# EAGLE design ArduOSD (EAGLE 6.0)
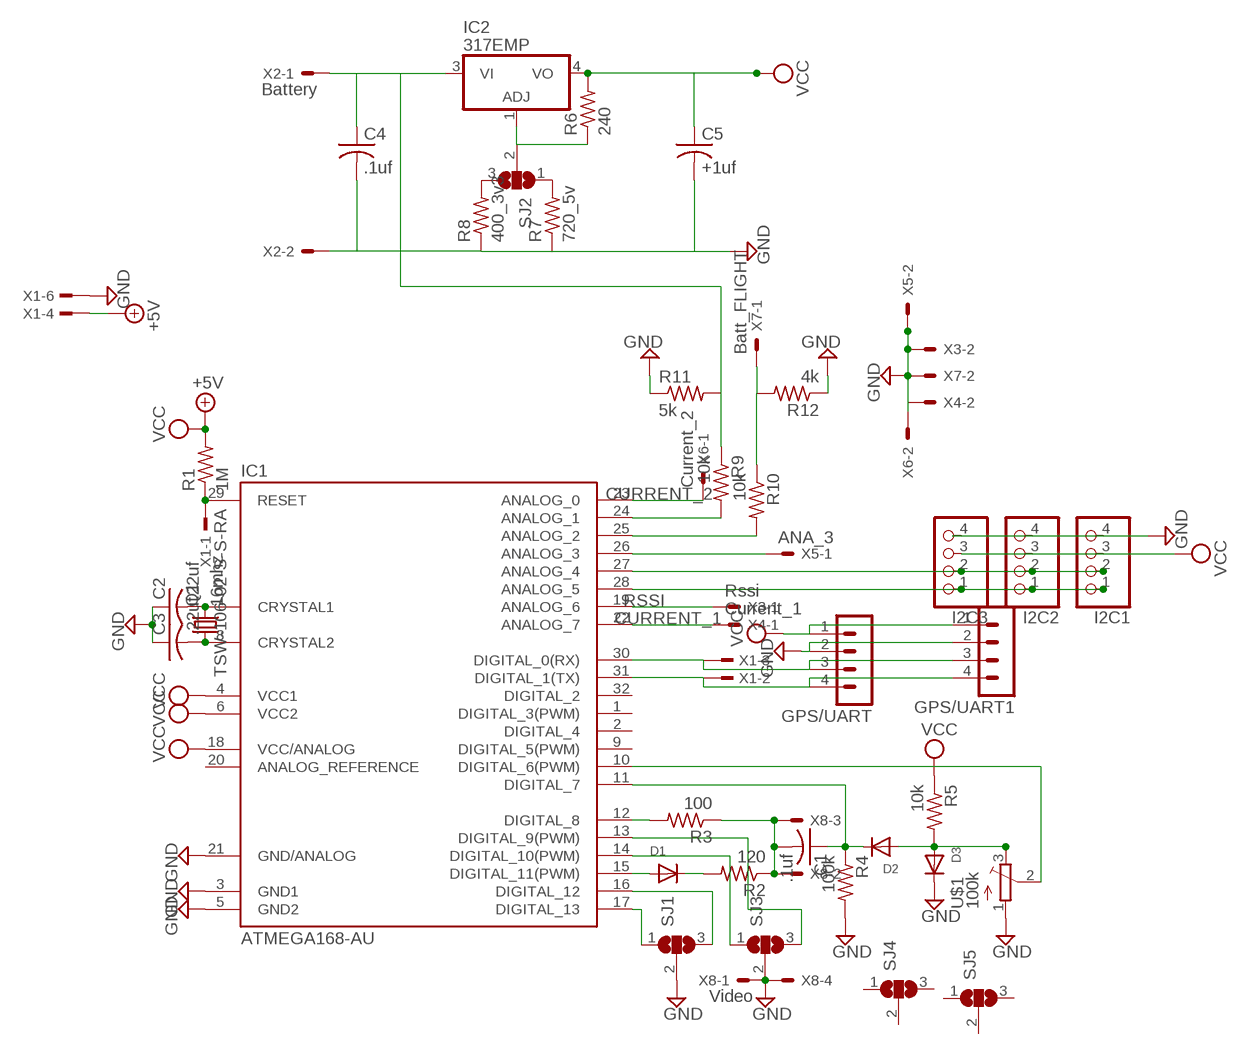
[diagram p0: schematic, sheet 1]

## Parts
C1  .1uf  C-USC0805K  [C0805K]
C2  .22uf  C-USC0805K  [C0805K]
C3  .22uf  C-USC0805K  [C0805K]
C4  .1uf  C-USC0805K  [C0805K]
C5  +1uf  C-US025-060X050  [C025-060X050]
D1  DIODESOT23_WAVE  [SOT23-W]
D2  DIODESOT23_WAVE  [SOT23-W]
D3  DIODESOT23_WAVE  [SOT23-W]
GPS/UART  MA04-1  [MA04-1]
GPS/UART1  MA04-1  [MA04-1]
I2C1  PINHD-1X4  [1X04]
I2C2  PINHD-1X4  [1X04]
I2C3  PINHD-1X4  [1X04]
IC1  ATMEGA168-AU  [TQFP32-08]
IC2  317EMP  [SOT223]
Q1  16mhz  CSM-7X-DU  [CSM-7X-DU]
R1  1M  R-US_M0805  [M0805]
R2  120  R-US_M0805  [M0805]
R3  100  R-US_M0805  [M0805]
R4  100k  R-US_M0805  [M0805]
R5  10k  R-US_M0805  [M0805]
R6  240  R-US_R0805  [R0805]
R7  720_5v  R-US_R0805  [R0805]
R8  400_3v3  R-US_R0805  [R0805]
R9  10k  R-US_M0805  [M0805]
R10  10k  R-US_M0805  [M0805]
R11  5k  R-US_M0805  [M0805]
R12  4k  R-US_M0805  [M0805]
SJ1  SJ2W  [SJ_2]
SJ2  SJ2W  [SJ_2]
SJ3  SJ2W  [SJ_2]
SJ4  SJ2W  [SJ_2]
SJ5  SJ2W  [SJ_2]
U$1  100k  TRIMPOTTC33X  [TC33X]
X1  TSW-106-02-S-S-RA  [TSW-106-02-S-S-RA]
X2  Battery  22-23-2021  [22-23-2021]
X3  Rssi  22-23-2021  [22-23-2021]
X4  Current_1  22-23-2021  [22-23-2021]
X5  ANA_3  22-23-2021  [22-23-2021]
X6  Current_2  22-23-2021  [22-23-2021]
X7  Batt_FLIGHT  22-23-2021  [22-23-2021]
X8  Video  22-23-2041  [22-23-2041]

## Nets
+5V: X1.4
ANA_3: IC1.26(ANALOG_3) X5.1
BATT_FPV: C4.1 IC2.3(VI) R9.1 R11.2 X2.1
CURRENT_1: IC1.22(ANALOG_7) X4.1
CURRENT_2: IC1.23(ANALOG_0) X6.1
GND: C2.1 C3.1 C4.2 C5.2 D3.3(C) GPS/UART1.2 GPS/UART.2 I2C1.4 I2C2.4 I2C3.4 IC1.3(GND1) IC1.5(GND2) IC1.21(GND/ANALOG) R4.2 R7.1 R8.1 R11.1 R12.1 SJ1.2 SJ3.2 U$1.1(A) X1.6 X2.2 X3.2 X4.2 X5.2 X6.2 X7.2 X8.1 X8.4
GPS_DAT: GPS/UART1.3 GPS/UART.3 IC1.30(DIGITAL_0(RX)) X1.3
N$1: IC1.29(RESET) R1.1 X1.1
N$2: D1.1(A) IC1.15(DIGITAL_11(PWM))
N$3: D1.3(C) R2.2
N$4: IC1.12(DIGITAL_8) R3.2
N$5: C1.2 R2.1 R3.1 X8.2 X8.3
N$6: C1.1 D2.3(C) IC1.11(DIGITAL_7) R4.1
N$7: D2.1(A) D3.1(A) R5.2 U$1.3(E)
N$8: IC1.10(DIGITAL_6(PWM)) U$1.2(S)
N$9: GPS/UART1.4 GPS/UART.4 IC1.31(DIGITAL_1(TX)) X1.2
N$11: C2.2 IC1.7(CRYSTAL1) Q1.2
N$12: C3.2 IC1.8(CRYSTAL2) Q1.1
N$13: IC1.25(ANALOG_2) R10.2
N$14: IC1.24(ANALOG_1) R9.2
N$15: IC1.16(DIGITAL_12) SJ1.3
N$16: IC1.17(DIGITAL_13) SJ1.1
N$17: IC2.1(ADJ) R6.1 SJ2.2
N$18: R7.2 SJ2.1
N$19: R10.1 R12.2 X7.1
N$20: R8.2 SJ2.3
N$21: IC1.14(DIGITAL_10(PWM)) SJ3.1
N$22: IC1.13(DIGITAL_9(PWM)) SJ3.3
RSSI: IC1.19(ANALOG_6) X3.1
SCL: I2C1.1 I2C2.1 I2C3.1 IC1.28(ANALOG_5)
SDA: I2C1.2 I2C2.2 I2C3.2 IC1.27(ANALOG_4)
VCC: C5.1 GPS/UART1.1 GPS/UART.1 I2C1.3 I2C2.3 I2C3.3 IC1.4(VCC1) IC1.6(VCC2) IC1.18(VCC/ANALOG) IC2.4(VO) R1.2 R5.1 R6.2 ; supply symbol labelled +5V
Unconnected: IC1.1(DIGITAL_3(PWM)) IC1.2(DIGITAL_4) IC1.9(DIGITAL_5(PWM)) IC1.20(ANALOG_REFERENCE) IC1.32(DIGITAL_2) SJ4.1 SJ4.2 SJ4.3 SJ5.1 SJ5.2 SJ5.3 X1.5

## Library data of the parts
C1-C5 = adafruit:C-US: CAPACITOR, American symbol
D1-D3 = adafruit:DIODE: Diode SMADIODE - SMA Surface Mount Package 20V 1A Schottky Diode Digikey: 641-1014-6-ND DO-1N4148 - Through Hole Small Current Diode SOD-123 20V 1 A (.5mV Vf) Schottky Diode - Digikey: MBRX120TPMSCT-ND SOD-323 10V 570mA (.38mV Vf, 3ns) Schottky Diode - Digikey: ZLLS410CT-ND SOD-523 30V 30mA Schottky Diode (RB751S-40TE61) - Digikey: RB751S-40TE61CT-ND SOT23-R/W - SOT23 Package (R = Solder Paste/Reflow Ovens, W = Hand-Soldering) BAT54Film 40V 300mA - Digikey: 497-7162-1-ND
GPS/UART GPS/UART1 = con-lstb:MA04-1: PIN HEADER; OC_FARNELL: unknown; OC_NEWARK: unknown
I2C1-I2C3 = pinhead:PINHD-1X4: PIN HEADER
IC1 = Arduino-AVR:ATMEGA168
IC2 = linear:*317: Positive VOLTAGE REGULATOR
Q1 = crystal:CSM-7X-DU: SMD CRYSTAL Source: www.ecsxtal.com .. Crystal 3.6864MHz CSM_7X_DU.PDF; OC_FARNELL: unknown; OC_NEWARK: unknown
R1-R12 = adafruit:R-US_: RESISTOR, American symbol
SJ1-SJ5 = jumper:SJ2W: SMD solder JUMPER
U$1 = adafruit:TRIMPOT: SMT trimmer potentiometer part number TC33X http://www.ladyada.net/library/eagle
X1 = con-samtec:TSW-106-02-S-S: THROUGH-HOLE .025" SQ POST HEADER Source: Samtec TSW.pdf; OC_FARNELL: unknown; OC_NEWARK: unknown
X2-X7 = con-molex:22-23-2021: .100" (2.54mm) Center Header - 2 Pin; MF: MOLEX; MPN: 22-23-2021; OC_FARNELL: 1462926; OC_NEWARK: 25C3832
X8 = con-molex:22-23-2041: .100" (2.54mm) Center Header - 4 Pin; MF: MOLEX; MPN: 22-23-2041; OC_FARNELL: 1462920; OC_NEWARK: 38C0355

## Board
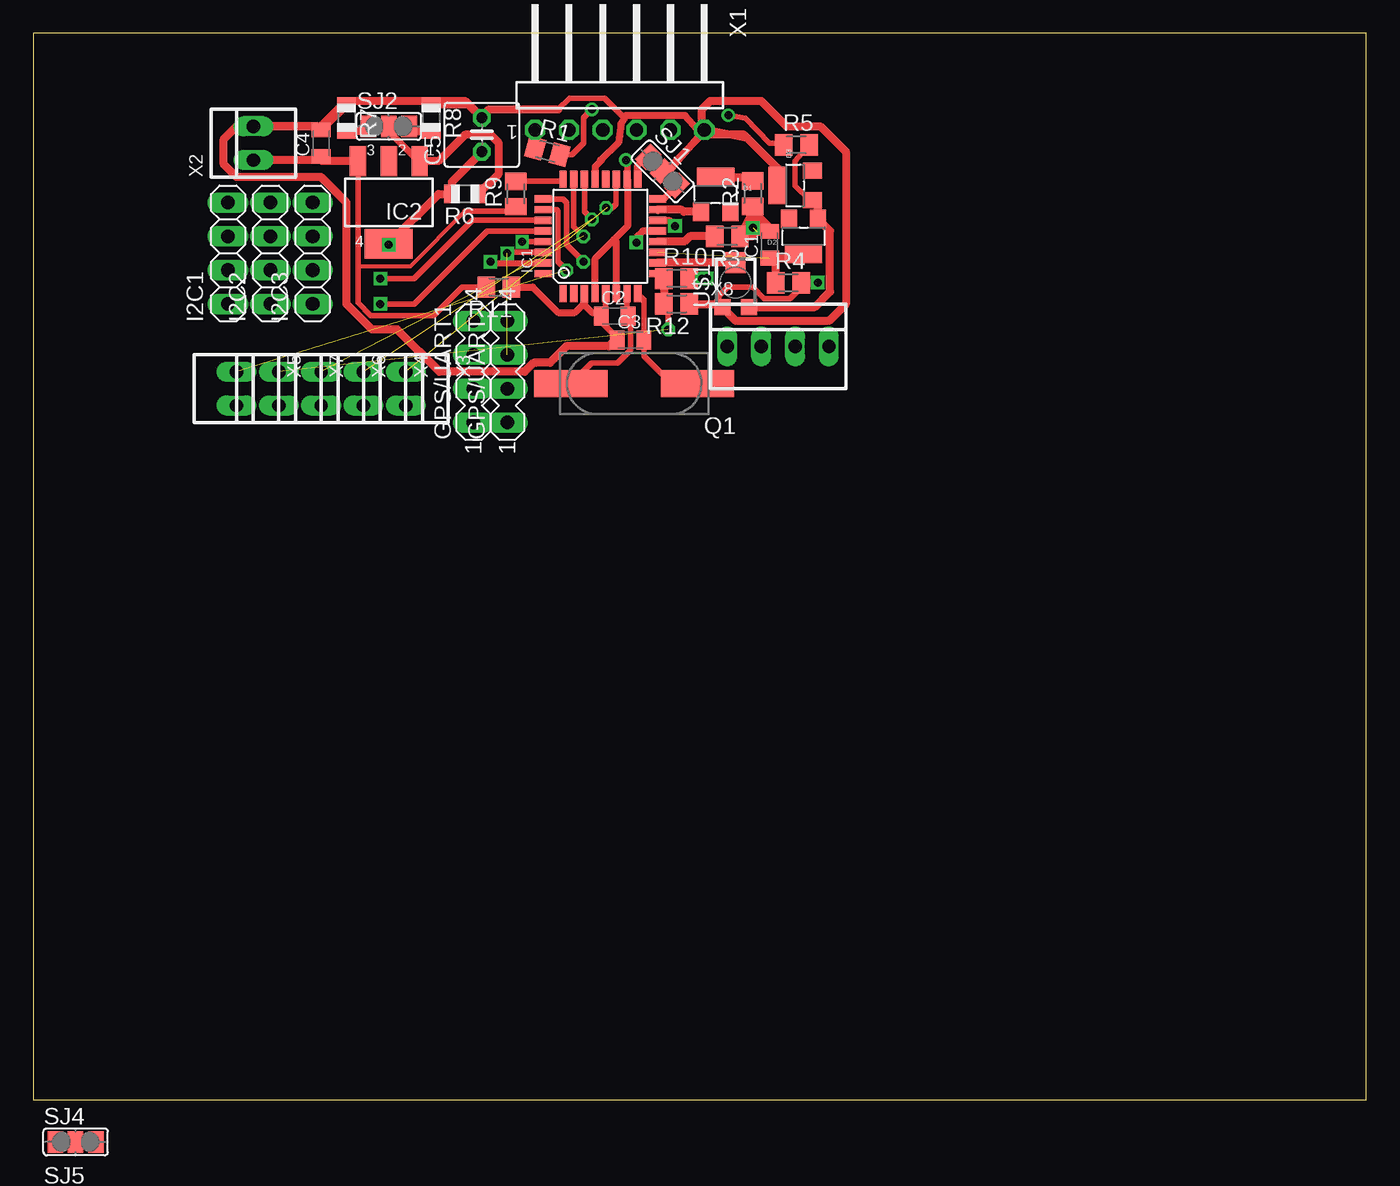
[diagram p1: board, top side]
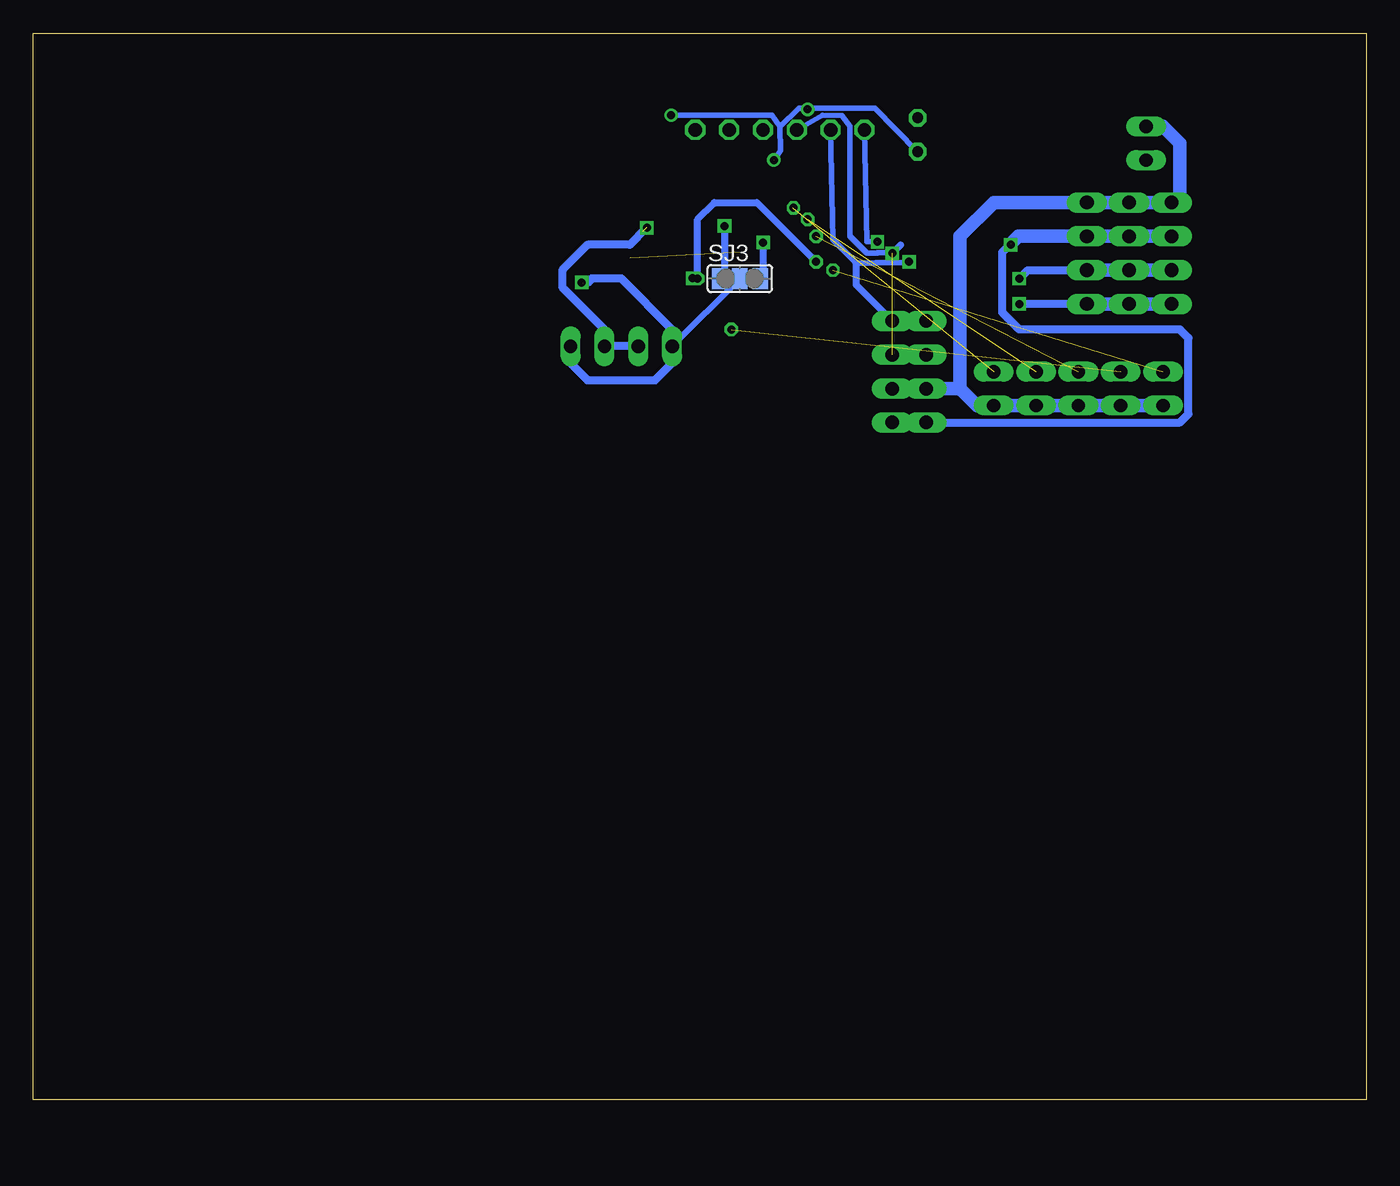
[diagram p2: board, bottom side, seen from below]

Size 100 x 80 mm. Coordinates in mm from the lower left corner, seen from the top.
Outline: 0,0 100,0 100,80 0,80 0,0
Copper layers (1*16): Top 0.035mm / dielectric 1.5mm / Bottom 0.035mm
Design rules: minimum track width 10mil, minimum drill 24mil, track to track 8mil, track to pad 8mil, pad to pad 8mil, via to via 8mil, smd to smd 8mil, copper to edge 40mil, drill to drill 8mil, minimum pad ring 10mil, minimum via ring 8mil, stop-mask expansion 4mil, vias tented up to drill 0mil, thermal gap 10mil

### Footprints (pad centres in the part's own frame; a part is rotated, then mirrored left to right if it is on the bottom)
C0805K = smd 1.1 x 1.4: 1 -1,0; 2 1,0
C025-060X050 = drill 0.813 octagon: 1 -1.27,0; 2 1.27,0
SOT23-W = smd 1.2 x 1.4: 1 -1.1,-1.3; 2 1.1,-1.3 | smd 2.8 x 1.4: 3 0,1.3
MA04-1 = drill 1.016 long: 1 -3.81,0; 2 -1.27,0; 3 1.27,0; 4 3.81,0
1X04 = drill 1.016 long: 1 -3.81,0; 2 -1.27,0; 3 1.27,0; 4 3.81,0
TQFP32-08 = smd 1.27 x 0.559: 1 -4.293,2.8; 2 -4.293,2; 3 -4.293,1.2; 4 -4.293,0.4; 5 -4.293,-0.4; 6 -4.293,-1.2; 7 -4.293,-2; 8 -4.293,-2.8; 17 4.293,-2.8; 18 4.293,-2; 19 4.293,-1.2; 20 4.293,-0.4; 21 4.293,0.4; 22 4.293,1.2; 23 4.293,2; 24 4.293,2.8 | smd 0.559 x 1.27: 9 -2.8,-4.293; 10 -2,-4.293; 11 -1.2,-4.293; 12 -0.4,-4.293; 13 0.4,-4.293; 14 1.2,-4.293; 15 2,-4.293; 16 2.8,-4.293; 25 2.8,4.293; 26 2,4.293; 27 1.2,4.293; 28 0.4,4.293; 29 -0.4,4.293; 30 -1.2,4.293; 31 -2,4.293; 32 -2.8,4.293
SOT223 = smd 1.219 x 2.235: 1 -2.311,-3.099; 2 0,-3.099; 3 2.311,-3.099 | smd 3.6 x 2.2: 4 0,3.099
CSM-7X-DU = smd 5.5 x 2: 1 -4.75,0; 2 4.75,0
M0805 = smd 1.3 x 1.6: 1 -0.95,0; 2 0.95,0
R0805 = smd 1.1 x 1.4: 1 -1,0; 2 1,0
SJ_2 = smd 1.168 x 1.6: 1 -1.524,0; 2 0,0; 3 1.524,0
TC33X = smd 1.2 x 1.2: 1 -1,-1.825; 3 1,-1.825 | smd 1.5 x 1.6: 2 0,1.5
TSW-106-02-S-S-RA = drill 1 pad 1.5 octagon: 1 6.35,1.524; 2 3.81,1.524; 3 1.27,1.524; 4 -1.27,1.524; 5 -3.81,1.524; 6 -6.35,1.524
22-23-2021 = drill 1 long: 1 -1.27,0; 2 1.27,0
22-23-2041 = drill 1 long: 1 -3.81,0; 2 -1.27,0; 3 1.27,0; 4 3.81,0

### Placement (x,y rotation side)
C1  55.24,64.14 90 top
C2  43.62,58.78 0 top
C3  44.81,56.98 0 top
C4  21.59,71.75 90 top
C5  33.66,72.39 90 top
D1  51.19,67.9 0 top
D2  57.78,64.77 180 top
D3  57.15,68.58 90 top
GPS/UART  35.56,54.61 90 top
GPS/UART1  33.02,54.61 90 top
I2C1  14.61,63.5 90 top
I2C2  17.78,63.5 90 top
I2C3  20.95,63.5 90 top
IC1  42.55,64.77 90 top
IC2  26.67,67.31 180 top
Q1  45.09,53.71 180 top
R1  38.57,71.14 345 top
R2  53.98,67.97 90 top
R3  52.07,64.77 180 top
R4  56.65,61.26 0 top
R5  57.25,71.62 0 top
R6  32.38,67.94 180 top
R7  23.5,73.66 270 top
R8  29.84,73.66 270 top
R9  36.2,67.94 90 top
R10  48.26,61.59 0 top
R11  34.92,60.96 180 top
R12  48.26,59.69 180 top
SJ1  47.22,69.64 315 top
SJ2  26.67,73.03 0 top
SJ3  46.99,61.59 0 bottom
SJ4  3.17,-3.17 0 top  (outside the outline)
SJ5  3.17,-7.62 0 top  (outside the outline)
U$1  52.69,61.29 0 top
X1  43.99,74.28 180 top
X2  16.51,71.75 90 top
X3  27.94,53.34 270 top
X4  24.77,53.34 270 top
X5  15.24,53.34 270 top
X6  21.59,53.34 270 top
X7  18.41,53.34 270 top
X8  55.88,56.52 0 top

### Tracks (layer width: path | path; a pad name or v marks a point on that pad's centre or on a via)
ANA_3  (via drill 0.6)  (1 unrouted)
  Top 0.406: IC1.26 39.27,66.77 39.37,66.67 39.37,62.87 v40.01,62.23
BATT_FPV
  Top 0.305: 32.38,66.67 28.27,62.5 24.37,62.5
  Top 0.406: IC2.3 24.36,70.34 24.37,62.5 24.37,60.11 24.37,60.21 24.37,59.79 25.32,58.83 30.05,58.83 32.16,60.96 R11.2 | R9.1 35.88,66.67 32.38,66.67
  Top 0.61: IC2.3 21.67,70.41 21.59,70.48 C4.1 21.32,70.48 X2.1
CURRENT_1  (via drill 0.6)  (1 unrouted)
  Top 0.406: IC1.22 41.34,66.61 v41.91,66.04
CURRENT_2  (via drill 0.6)  (1 unrouted)
  Top 0.406: IC1.23 40.55,65.5 v41.27,64.77
GND  (1 unrouted)
  Top 0: IC1.5 42.8,60.33 42.8,58.8 43.8,56.87 42.96,56.51 39.86,56.33 38.6,55.37 37.35,55.12 36.85,54.62 30.58,54.57 27.24,57.77 25.41,57.83 23.47,59.81 23.48,67.38 21.57,69.21 14.86,69.48 14.27,70.6 14.36,72.21 15.31,73.03 21.8,73 23.26,74.37 24.26,74.91 32.72,74.67 33.69,73.79
  Top 0.406: 42.95,58.02 42.62,58.35 C2.1 42.95,59.1 IC1.5 42.95,58.02 | C3.1 43.81,57.14 43.81,57.15 42.95,58.02 | R4.2 57.6,60.93 56.78,60.11 54.83,60.11 53.98,60.96 52.07,60.96 51.44,60.33 51.44,59.72 U$1.1 | 39.37,74.3 40.21,75.14 42.85,75.14 44.16,73.83 44.46,73.83
  Top 0.508: X1.6 47.67,69.64 SJ1.2 47.42,69.64 50.16,72.39 48.91,73.83 44.46,73.83 44.08,73.21 43.9,71.8 42.55,70.48 42.64,70.48 42.16,70.01 42.16,69.08 IC1.21 | R11.1 37.47,60.96 39.37,59.05 40.64,59.05 41.27,59.69 | 41.27,59.69 41.27,59.73 41.37,59.83 41.37,60.45 IC1.3 41.34,59.76 41.27,59.69 | 41.27,59.69 41.91,59.05 42.34,59.05 C2.1
  Top 0.61: 23.77,74.93 R7.1 C4.2 | 23.77,74.93 29.84,74.93 | 29.84,74.93 R8.1 32.66,74.66 C5.2 32.38,74.93 29.84,74.93 | C4.2 21.59,73.03 | R4.2 58.77,61.26 58.78,61.27 | R12.1 51.47,59.69 U$1.1 51.69,59.43 52.7,58.42 59.69,58.42 60.96,59.69 60.96,71.12 59.05,73.03 56.52,73.03 54.61,74.93 50.8,74.93 50.16,74.3 50.16,72.39 53.34,72.39 53.59,72.14 | 53.59,72.14 55.88,69.85 55.88,68.61 D3.3 | 53.59,72.14 X1.6 | 43.81,57.15 43.18,56.52 40.01,56.52 38.78,55.29 37.7,55.29 37.69,55.29 37.54,55.29 36.87,54.61 30.48,54.61 27.3,57.78 25.4,57.78 23.5,59.69 23.5,67.31 21.59,69.22 15.24,69.22 14.29,70.17 14.29,72.07 15.24,73.03 X2.2 | C4.2 21.32,73.03 X2.2 | X2.2 21.59,73.03 | 21.59,73.03 23.5,74.93 23.77,74.93 | 33.69,73.79 34.2,74.3 39.37,74.3
  Bottom 0.406: SJ3.2 X8.1
  Bottom 0.61: 58.77,61.26 58.42,61.26 58.09,61.59 55.88,61.59 52.07,57.78 X8.1 52.07,55.24 53.34,53.98 58.42,53.98 59.69,55.24 X8.4
  Bottom 1.016: I2C1.4 I2C2.4 I2C3.4 | X5.2 X7.2 X6.2 X4.2 X3.2 29.21,52.07 30.48,53.34 | I2C3.4 13.97,67.31 13.97,71.75 15.24,73.03 X2.2 | 30.48,53.34 30.48,64.77 27.94,67.31 I2C3.4 | GPS/UART.2 GPS/UART1.2 30.48,53.34
GPS_DAT  (via drill 0.6 pad 0.81)  (1 unrouted)
  Top 0.406: IC1.30 35.63,63.57 v35.56,63.5
  Bottom 0.406: X1.3 42.74,72.73 40.81,73.85 39.31,73.83 38.73,73.03 38.73,64.77 37.47,63.5 36.69,63.5 36.66,63.53 35.59,63.53 v35.56,63.5
  Bottom 0.508: v35.56,63.5 34.92,64.14
  Bottom 1.016: GPS/UART1.3 GPS/UART.3
N$1  (1 unrouted)
  Top 0.406: IC1.29 36.7,64.37 36.69,64.38 36.69,64.36 | R1.1 37.65,72.84 37.47,73.03 37.47,72.93 X1.1
  Bottom 0.406: X1.1 37.47,64.39 37.45,64.37 36.69,64.37 36.69,64.36
N$2
  Top 0.61: D1.1 48.8,66.6 48.64,66.77 IC1.15
N$3
  Top 0.61: D1.3 53.7,69.2 R2.2
N$4
  Top 0.61: R3.2 49.25,64.77 48.85,64.37 IC1.12
N$5  (1 unrouted)
  Top 0.61: R3.1 53.79,64.77 | 53.79,64.77 53.91,64.77 54.28,65.13 C1.2 | R2.1 53.98,64.95 53.79,64.77
  Bottom 0.61: 53.98,65.41 55.25,64.14 58.42,64.14 60.33,62.23 60.33,60.96 57.15,57.78 X8.3 X8.2
N$6  (1 unrouted)
  Top 0.61: R4.1 55.7,62.68 C1.1 57.45,63.13 D2.3
N$7
  Top 0.406: D3.1 58.25,67.48 57.15,68.58 57.15,70.42 R5.2
  Top 0.61: D3.1 58.88,67.05 D2.1 59.78,65.17 59.78,60.61 58.64,59.47 U$1.3
N$8
  Top 0.61: U$1.2 46.82,62.79 46.81,62.78 IC1.10
N$9  (via drill 0.6 pad 0.81)
  Top 0.406: IC1.31 34.38,62.77 v34.29,62.87 34.44,62.72 38.23,62.72
  Bottom 0.406: X1.2 40.01,64.52 IC1.31 36.79,62.77 36.78,62.78 34.37,62.78 v34.29,62.87
  Bottom 0.508: GPS/UART.4 38.25,61.11 IC1.31
  Bottom 1.016: GPS/UART1.4 GPS/UART.4
N$10  (via drill 0.6 pad 0.81)
  other vias: 58.85,61.31
N$11
  Top 0.406: IC1.7 44.55,58.85 C2.2 44.62,58.33 44.8,58.15 44.8,56.23 43.81,55.24 41.87,55.24 Q1.2
N$12
  Top 0.406: IC1.8 45.81,60.01 C3.2 45.81,55.79 47.62,53.98 49.57,53.98 Q1.1
N$13  (via drill 0.6)
  Top 0.406: IC1.25 39.74,67.57 40.01,67.31 40.01,64.14 v41.27,62.87
  Top 0.61: R10.2 v50.16,61.59 50.48,61.59 50.49,61.59
  Bottom 0.508: v50.16,61.59 50.16,66.04 48.9,67.31 45.72,67.31 v41.27,62.87
N$14
  Top 0.406: R9.2 39.51,68.89 39.75,69.14 IC1.24
N$15
  Top 0.508: IC1.16 47.3,67.57 SJ1.3
N$16
  Top 0.508: IC1.17 45.34,70.11 45.96,70.72 SJ1.1
N$17
  Top 0.508: SJ2.2 26.67,72.66 28.95,70.38 | 28.95,70.38 29.1,70.38 29.21,70.48 | IC2.1 28.95,70.38
  Top 0.61: R6.1 34.92,69.48 34.92,71.75 34.29,72.39 32.38,72.39 30.4,70.41 IC2.1
N$18
  Top 0.61: SJ2.1 24.78,72.66 R7.2
N$19  (via drill 0.6)  (1 unrouted)
  Top 0.406: R12.2 47.62,59.38 v47.62,57.78
  Top 0.61: R10.1 47.31,60.01 47.62,59.69 R12.2
N$20
  Top 0.61: SJ2.3 28.56,72.66 R8.2
N$21  (via drill 0.6 pad 0.81)
  Top 0.508: IC1.14 47.73,65.97 v48.16,65.54
  Bottom 0.508: v48.16,65.54 48.16,61.95 SJ3.1
N$22  (via drill 0.6 pad 0.81)
  Top 0.508: IC1.13 45.74,65.17 45.27,64.7 45.27,64.32 v45.26,64.31
  Bottom 0.508: v45.26,64.31 45.26,61.8 SJ3.3
N$23  (via drill 0.6 pad 0.81)
  other vias: 53.98,65.41
N$24
  Top 0.61: 53.98,66.67 55.24,65.41 53.98,66.04 54.61,65.41 53.98,66.67 | 53.98,66.67 53.34,65.41
N$25  (via drill 0.6 pad 0.81)
  other vias: 50.54,61.62
N$26  (via drill 0.6 pad 0.81)
  other vias: 36.67,64.35
N$27  (via drill 0.6 pad 0.81)
  other vias: 45.25,64.29
N$28  (via drill 0.6 pad 0.81)
  other vias: 48.14,65.54
N$29  (via drill 0.6 pad 0.81)
  other vias: 26.67,64.14
N$30  (via drill 0.6)
  other vias: 42.97,66.91
N$31  (via drill 0.6)
  other vias: 44.45,70.48
RSSI  (1 unrouted)
  Top 0.406: IC1.19 43.73,69.04 43.73,67.19 43.44,66.91 43.03,66.91
SCL  (via drill 0.6 pad 0.81)
  Top 0.406: IC1.28 34.05,65.17 28.57,59.69 v26.04,59.69
  Bottom 0.61: I2C3.1 v26.04,59.69
  Bottom 1.016: I2C1.1 I2C2.1 I2C3.1
SDA  (via drill 0.6 pad 0.81)
  Top 0.406: IC1.27 32.95,65.97 28.57,61.59 v26.04,61.59
  Bottom 0.61: v26.04,61.59 25.4,62.23 I2C3.2
  Bottom 1.016: I2C1.2 I2C2.2 I2C3.2
VCC  (via drill 0.6)  (3 unrouted)
  Top 0.406: R5.1 56.01,71.62 55.88,71.75 55.24,71.75 53.44,73.61 v52.15,73.86 | IC1.18 44.55,70.39 | 44.55,70.39 44.45,70.48 | 44.61,69 44.61,70.33 44.55,70.39 | R1.2 40.42,70.9 41.27,71.75 41.27,73.66 v41.91,74.3 41.91,74.38
  Top 0.508: IC1.4 42.15,63.1 43.56,64.52 | 43.56,64.52 44.45,65.41 44.61,65.56 44.61,69 IC1.18 | IC1.6 43.74,64.34 43.56,64.52
  Top 0.61: C5.1 31.39,68.85 R6.2 30.4,67.94 IC2.4
  Bottom 0.406: v52.15,73.86 44.56,73.86 43.99,72.98 | 44.45,70.48 43.94,71.17 43.99,72.98 | 43.99,72.98 42.56,74.38 36.84,74.38 C5.1
  Bottom 0.61: GPS/UART.1 13.97,50.8 13.34,51.44 13.34,57.15 13.97,57.78 26.04,57.78 27.3,59.05 27.3,63.58 IC2.4
  Bottom 1.016: I2C1.3 I2C2.3 I2C3.3 26.11,64.77 IC2.4 | GPS/UART1.1 GPS/UART.1